# EAGLE design attinier84-motherboard-mk-4.0 (EAGLE 6.5.0)
REVISION: 3.0
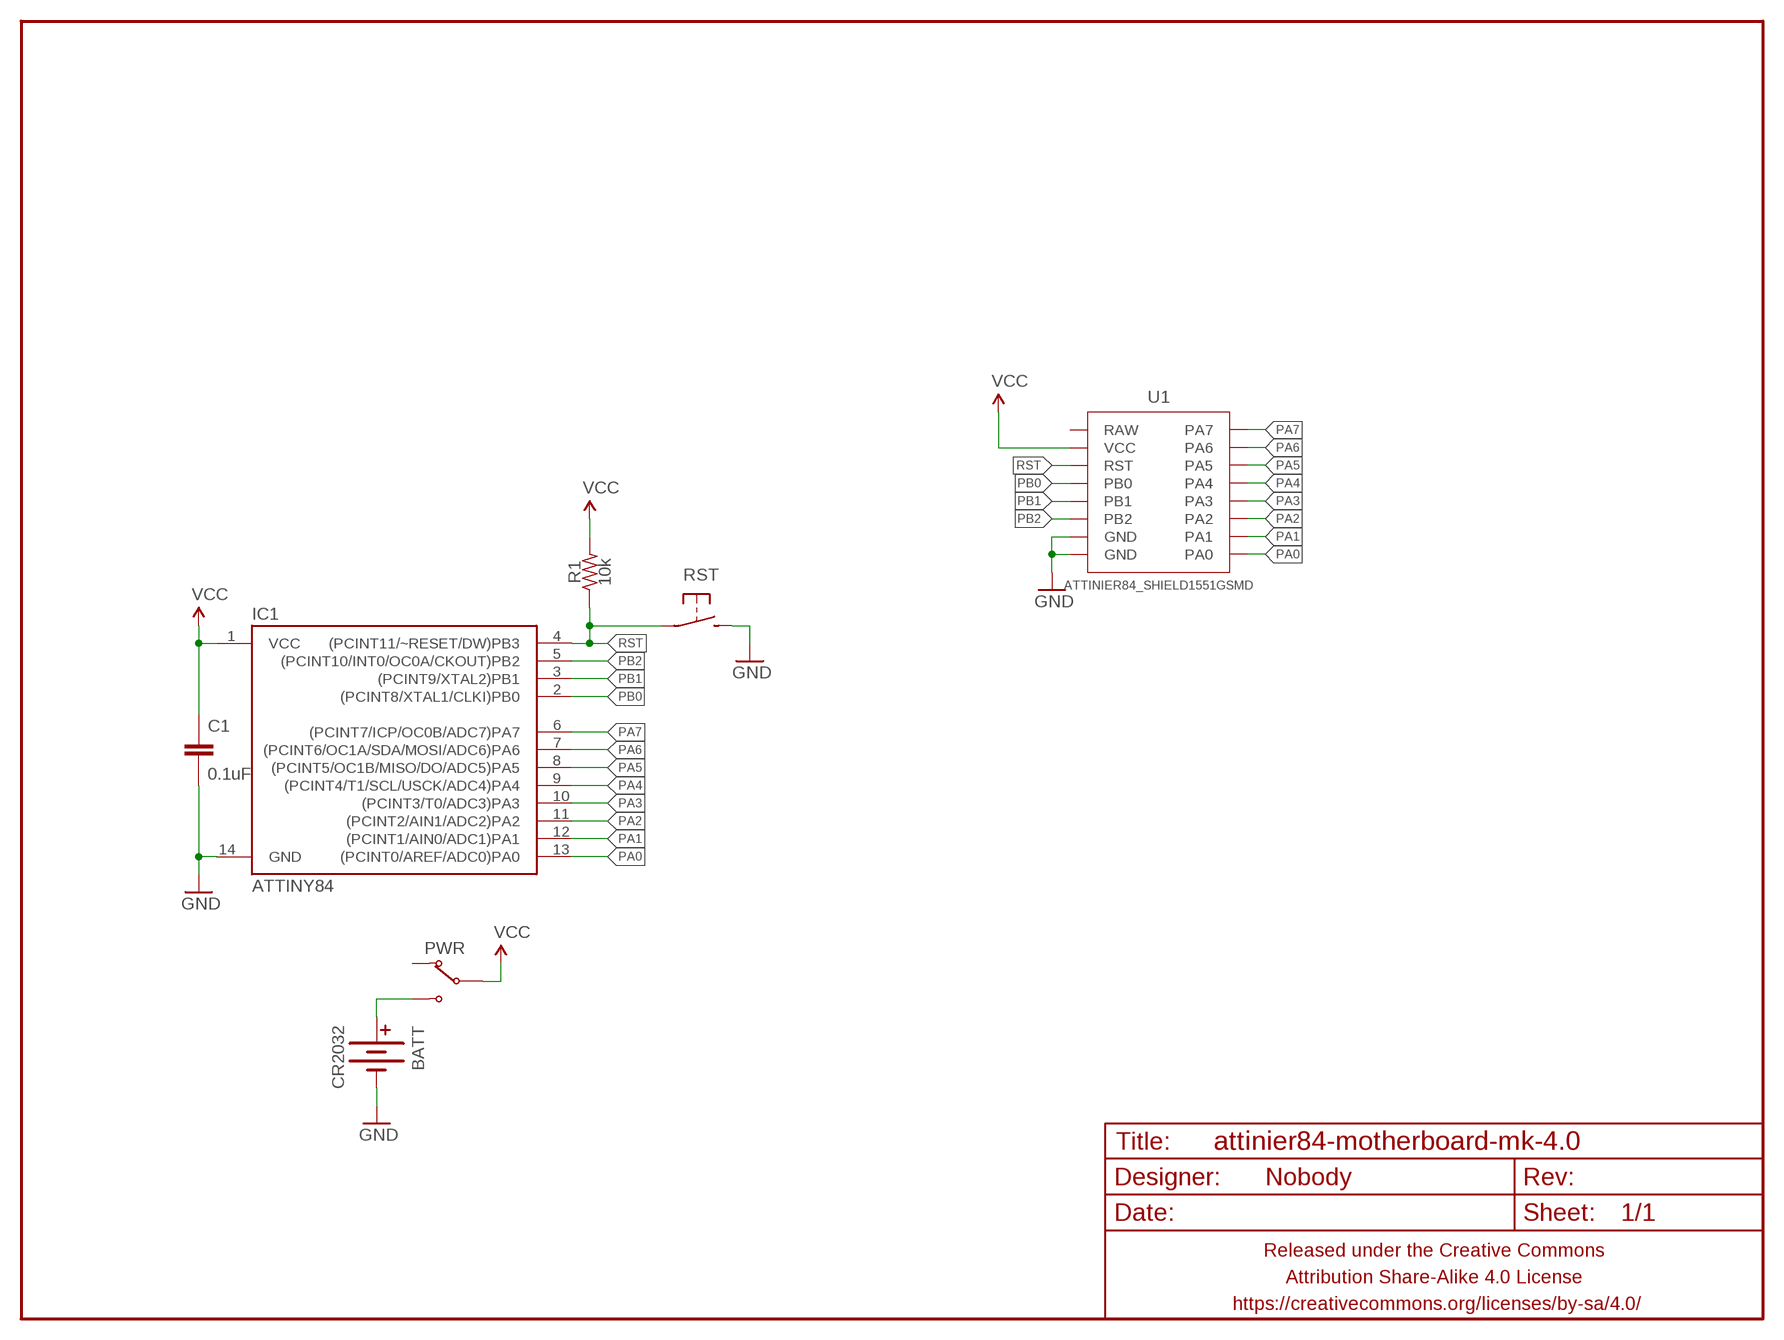
[diagram p0: schematic, sheet 1]

## Parts
BATT  CR2032  BATTERY20MM_SMD_TIGHT  [BATTCON_20MM_MINE_STAHPIT]
C1  0.1uF  CAPACITOR-CERAMICC0805  [C0805]
FRAME1  FRAME-LETTERNO_PACKAGE  [DUMMY]
IC1  ATTINY84  [SO14]
PWR  SWITCH-SPDTPTH-RA-2.54MM  [SPDT-RA-2.54MM]
R1  10k  RESISTORR0805  [R0805]
RST  SPST-NO-TACTCK-PTS840-GK  [TACTILE-SMD-CK-PTS840-GK]
U1  ATTINIER84_SHIELD1551GSMD  [ATTINIER84_SHIELD2_SMD]

## Nets
GND: BATT.BOTTOM(-) C1.2 IC1.14(GND) RST.3 RST.4 U1.GND@1(GND) U1.GND@2(GND)
N$1: BATT.TOP@1(+) BATT.TOP@2(+) PWR.3(NO)
PA0: IC1.13((PCINT0/AREF/ADC0)PA0) U1.PA0
PA1: IC1.12((PCINT1/AIN0/ADC1)PA1) U1.PA1
PA2: IC1.11((PCINT2/AIN1/ADC2)PA2) U1.PA2
PA3: IC1.10((PCINT3/T0/ADC3)PA3) U1.PA3
PA4: IC1.9((PCINT4/T1/SCL/USCK/ADC4)PA4) U1.PA4
PA5: IC1.8((PCINT5/OC1B/MISO/DO/ADC5)PA5) U1.PA5
PA6: IC1.7((PCINT6/OC1A/SDA/MOSI/ADC6)PA6) U1.PA6
PA7: IC1.6((PCINT7/ICP/OC0B/ADC7)PA7) U1.PA7
PB0: IC1.2((PCINT8/XTAL1/CLKI)PB0) U1.PB0
PB1: IC1.3((PCINT9/XTAL2)PB1) U1.PB1
PB2: IC1.5((PCINT10/INT0/OC0A/CKOUT)PB2) U1.PB2
RST: IC1.4((PCINT11/~RESET/DW)PB3) R1.1 RST.1 RST.2 U1.RST
VCC: C1.1 IC1.1(VCC) PWR.2(COM) R1.2 U1.VCC
Unconnected: PWR.1(NC) U1.RAW

## Library data of the parts
BATT = A_butts:BATTERY: Battery Holders Various common sizes : AA, AAA, 20mm coin cell and 12mm coin cell. 20MM_4LEGS, BATT-10373
C1 = A_butts:CAPACITOR-CERAMIC: CAPACITOR, European symbol
FRAME1 = A_butts:FRAME-LETTER: Schematic Frame Standard 8.5x11 US Letter frame; DESIGNER: Nobody
IC1 = A_butts:ATTINY84: Atmel 14-pin 2/4/8kB flash uC
PWR = A_butts:SWITCH-SPDT
R1 = A_butts:RESISTOR: RESISTOR, American symbol
RST = A_butts:SPST-NO-TACT
U1 = A_butts:ATTINIER84_SHIELD

## Board
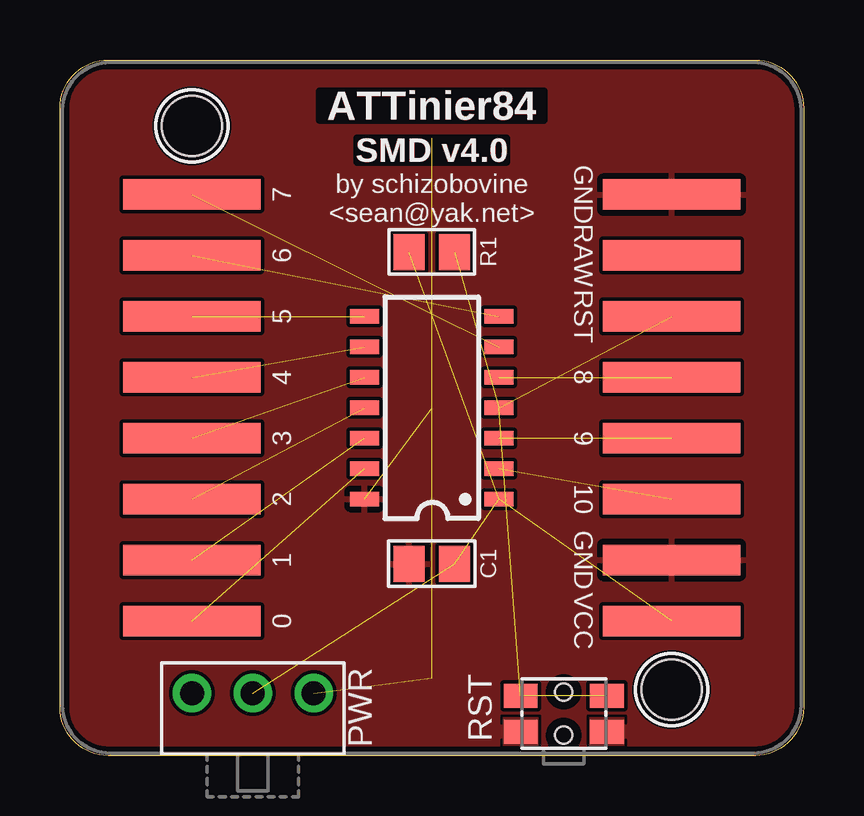
[diagram p1: board, top side]
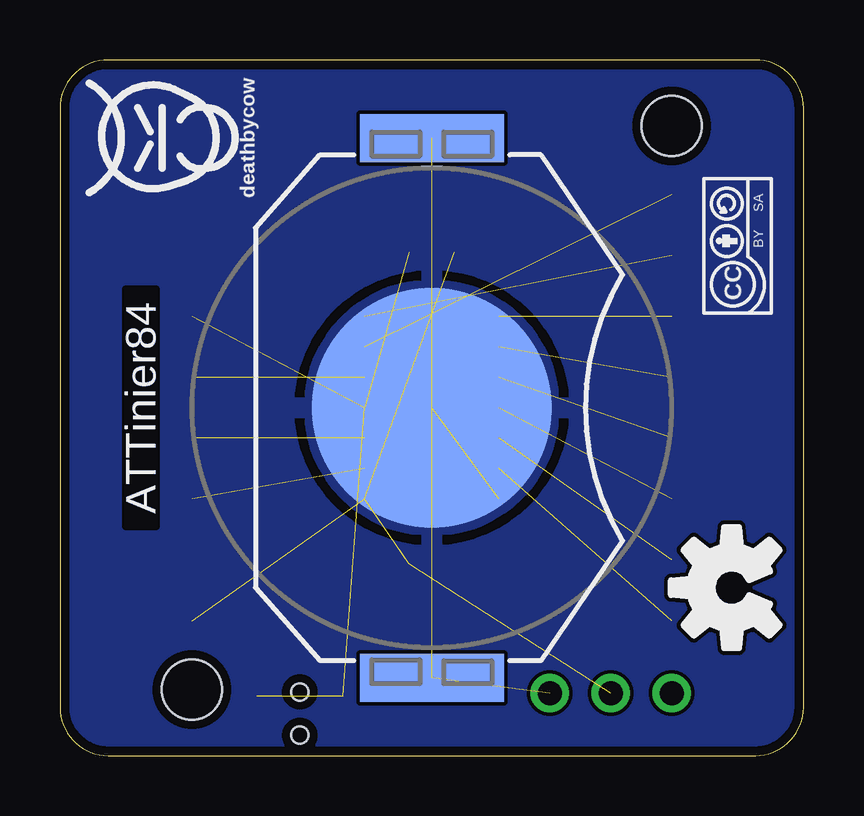
[diagram p2: board, bottom side, seen from below]

Size 31 x 29 mm. Coordinates in mm from the lower left corner, seen from the top.
Outline: 29,0 2,0 arc-90 0,2 0,27 arc-90 2,29 29,29 arc-90 31,27 31,2 arc-90 29,0
Copper layers (1*16): Top 0.0356mm / dielectric 1.5011mm / Bottom 0.0356mm
Design rules "LaenPCBOrder_2": minimum track width 6mil, minimum drill 13mil, track to track 6mil, track to pad 6mil, pad to pad 6mil, via to via 6mil, smd to smd 6mil, copper to edge 15mil, drill to drill 6mil, minimum pad ring 7mil, minimum via ring 7mil, stop-mask expansion 3mil, vias tented up to drill 20mil, thermal gap 10mil

### Footprints (pad centres in the part's own frame; a part is rotated, then mirrored left to right if it is on the bottom)
BATTCON_20MM_MINE_STAHPIT = smd 10 x 10: BOTTOM 0,0 | smd 6 x 2: TOP@1 0,11.25; TOP@2 0,-11.25
C0805 = smd 1.3 x 1.5: 1 -0.95,0; 2 0.95,0
SO14 = smd 0.6 x 1.2: 1 -3.81,-2.8; 2 -2.54,-2.8; 3 -1.27,-2.8; 4 0,-2.8; 5 1.27,-2.8; 6 2.54,-2.8; 7 3.81,-2.8; 8 3.81,2.8; 9 2.54,2.8; 10 1.27,2.8; 11 0,2.8; 12 -1.27,2.8; 13 -2.54,2.8; 14 -3.81,2.8
SPDT-RA-2.54MM = drill 1 pad 1.6: 1 0,0; 2 2.54,0; 3 5.08,0
R0805 = smd 1.3 x 1.5: 1 -0.95,0; 2 0.95,0
TACTILE-SMD-CK-PTS840-GK = smd 1.4 x 1: 1 -1.8,0.75; 2 1.8,0.75; 3 -1.8,-0.75; 4 1.8,-0.75 | hole 0.7: 0,-0.9; 0,0.9
ATTINIER84_SHIELD2_SMD = smd 5.715 x 1.27: GND@1 10,8.89; GND@2 10,-6.35; PA0 -10,-8.89; PA1 -10,-6.35; PA2 -10,-3.81; PA3 -10,-1.27; PA4 -10,1.27; PA5 -10,3.81; PA6 -10,6.35; PA7 -10,8.89; PB0 10,-3.81; PB1 10,-1.27; PB2 10,1.27; RAW 10,6.35; RST 10,3.81; VCC 10,-8.89 | hole 2.5: -10,11.75; 10,-11.75

### Placement (x,y rotation side)
BATT  15.5,14.5 0 bottom
C1  15.5,8 180 top
FRAME1  0,0 0 top
IC1  15.5,14.5 90 top
PWR  5.5,2.6 0 top
R1  15.5,21 180 top
RST  21,1.75 0 top
U1  15.5,14.5 0 top
U$1  [CC-BY-SA-4.0-NO-URL]  2.75,21.25 90 bottom
U$2  [COW_SMALL]  27.25,25.75 90 bottom
U$4  [OSHWLOGO_BOT_0.2_A]  3,7 270 top

### Tracks (layer width: path | path; a pad name or v marks a point on that pad's centre or on a via)
GND  (1 unrouted)
  pour Top: -0.1,-0.1 -0.1,29.1 31.1,29.1 31.1,-0.1
  pour Bottom: -0.1,-0.1 -0.1,29.1 31.1,29.1 31.1,-0.1
N$1  (2 unrouted)
PA0  (1 unrouted)
PA1  (1 unrouted)
PA2  (1 unrouted)
PA3  (1 unrouted)
PA4  (1 unrouted)
PA5  (1 unrouted)
PA6  (1 unrouted)
PA7  (1 unrouted)
PB0  (1 unrouted)
PB1  (1 unrouted)
PB2  (1 unrouted)
RST  (4 unrouted)
VCC  (4 unrouted)

### Text on the board
Top: ATTinier84
Bottom: ATTinier84
tPlace: ATTinier84 | by schizobovine / <sean@yak.net>
bPlace: ATTinier84